# Altium project flying_pcb_v1.2.PrjPcb (part 2 of 2)
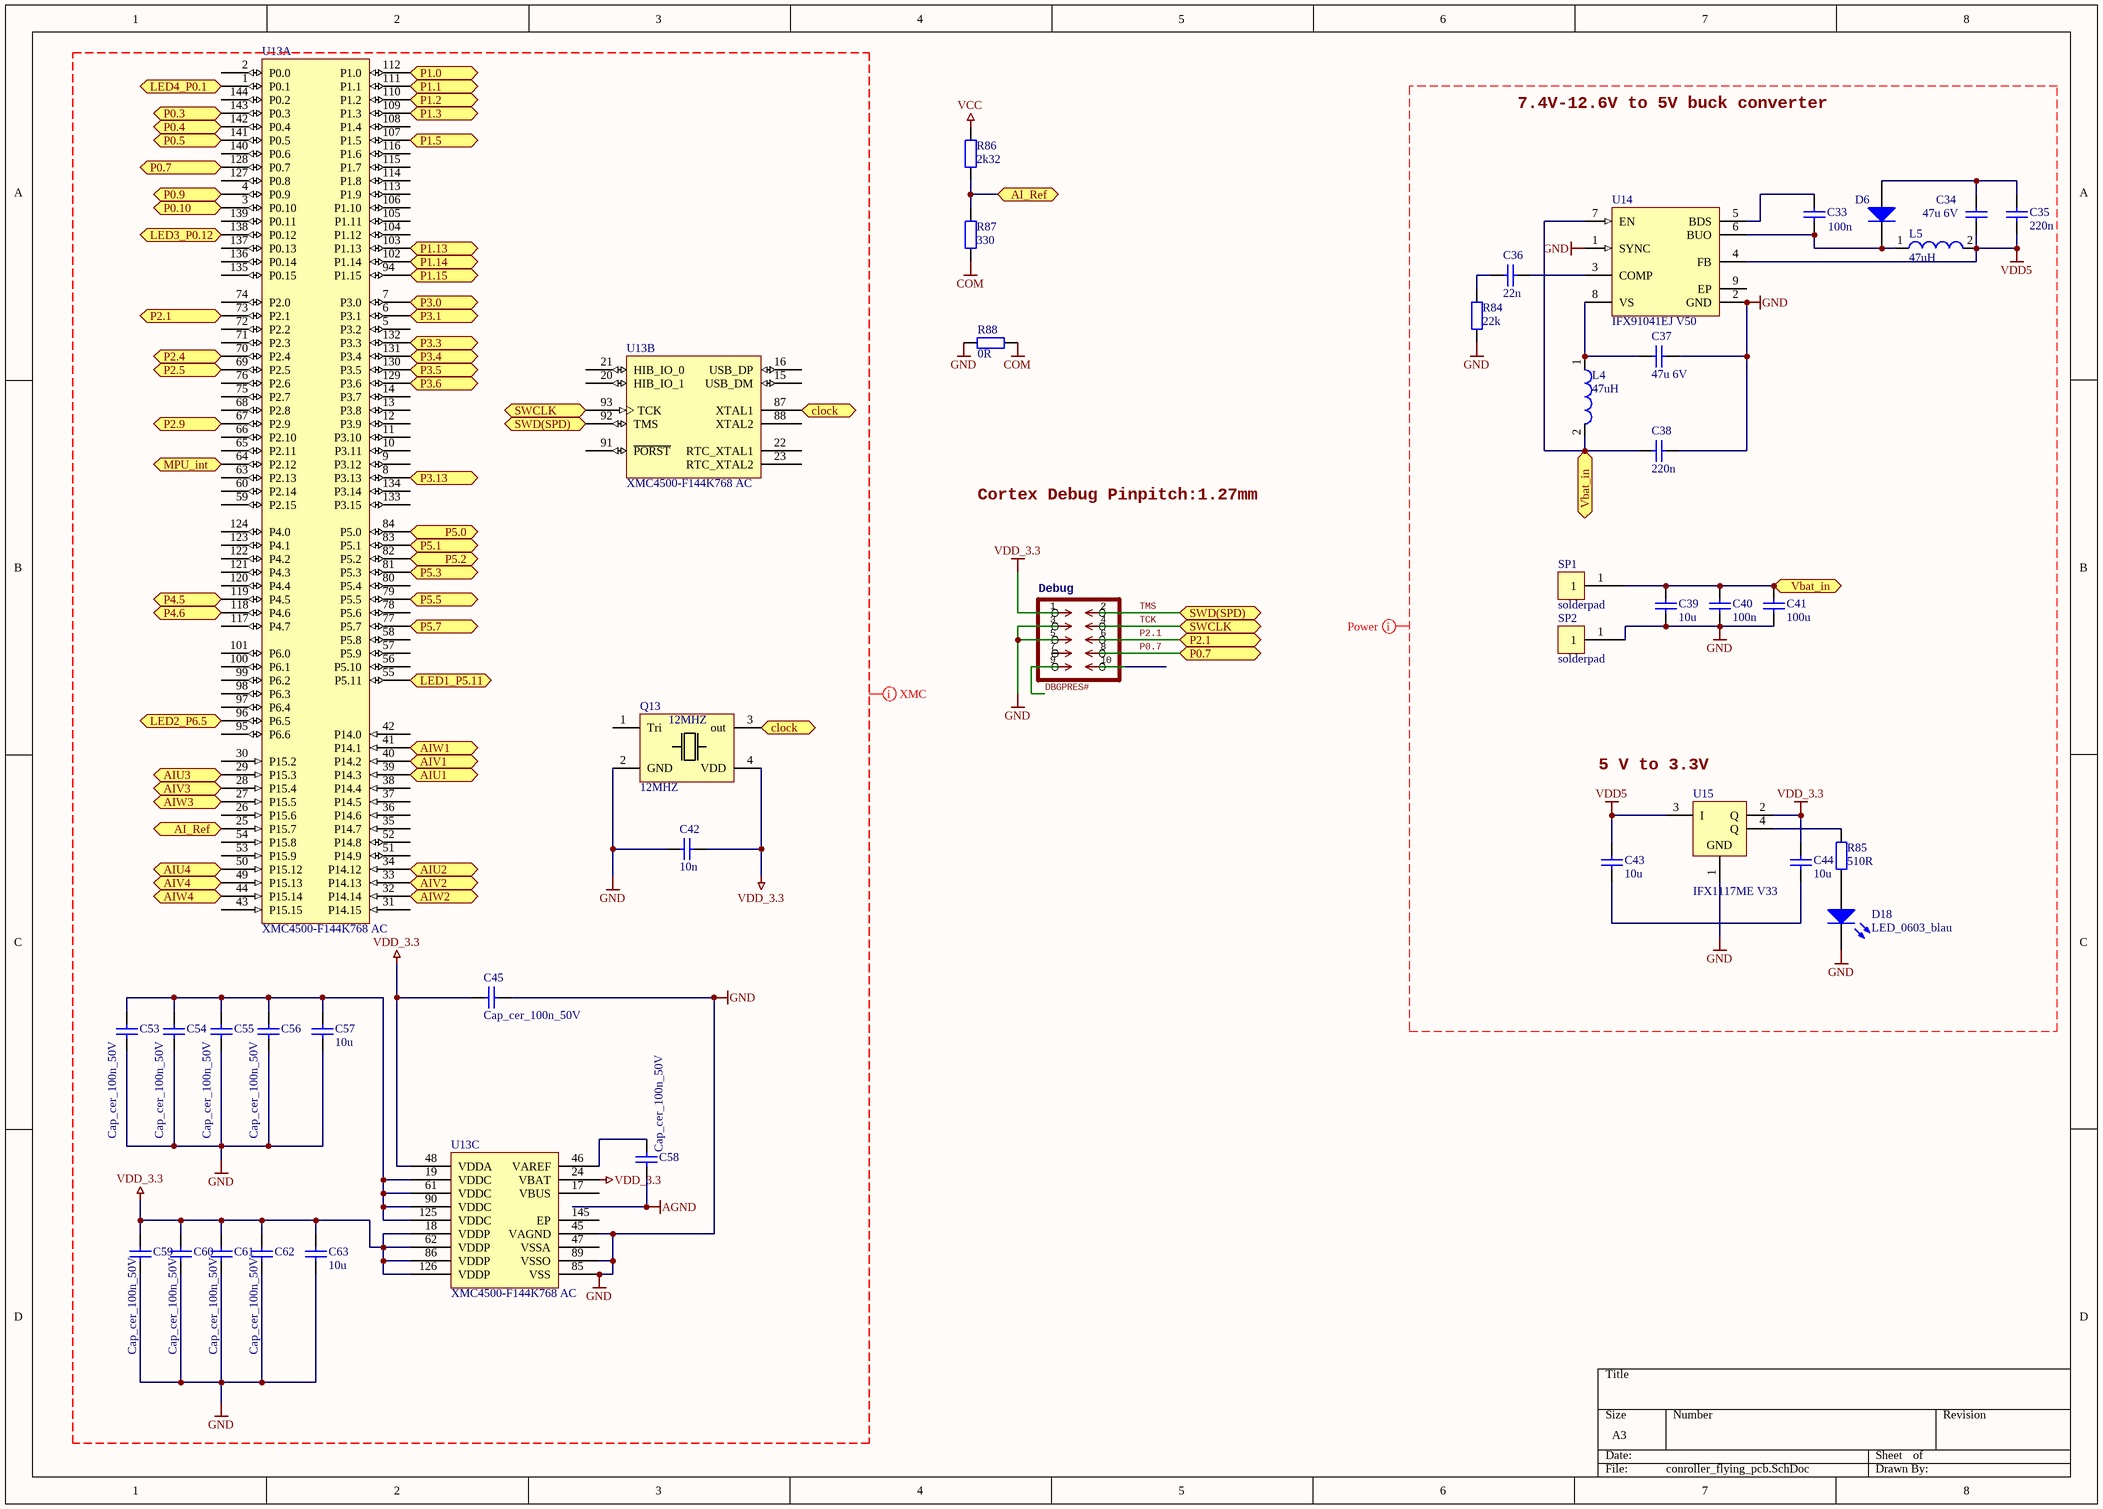
[diagram p7: conroller_flying_pcb.SchDoc]

## Nets that join several sheets
COM: Master_flying_pcb_v1 (24 pins), Slave1_flying_pcb_v1 (23 pins), Slave2_flying_pcb_v1 (23 pins), Slave3_flying_pcb_v1 (23 pins), Slave4_flying_pcb_v1 (23 pins), conroller_flying_pcb (R87.2 R88.2)
GND: Slave1_flying_pcb_v1 (D4.2), Slave2_flying_pcb_v1 (D8.2), Slave3_flying_pcb_v1 (D12.2), Slave4_flying_pcb_v1 (D16.2), Sensors_flying_pcb (38 pins), conroller_flying_pcb (30 pins)
VCC: Master_flying_pcb_v1 (24 pins), Slave1_flying_pcb_v1 (20 pins), Slave2_flying_pcb_v1 (20 pins), Slave3_flying_pcb_v1 (20 pins), Slave4_flying_pcb_v1 (20 pins), conroller_flying_pcb (R86.1)
VDD_3.3: Sensors_flying_pcb (21 pins), conroller_flying_pcb (17 pins)
NetDPS310_P3: Sensors_flying_pcb (DPS310.P3 R82.1), conroller_flying_pcb (U13.6)
NetDPS310_P4: Sensors_flying_pcb (DPS310.P4 R83.1), conroller_flying_pcb (U13.8)
NetDPS310_P5: Sensors_flying_pcb (DPS310.P5), conroller_flying_pcb (U13.7)
NetPAN1026_E6: Sensors_flying_pcb (PAN1026.E6 R79.2 RN42.UART_RX), conroller_flying_pcb (U13.83)
NetPAN1026_F7: Sensors_flying_pcb (PAN1026.F7 R78.2 RN42.UART_TX), conroller_flying_pcb (U13.107)
NetQ14_12: Sensors_flying_pcb (Q14.12), conroller_flying_pcb (U13.64)
NetQ14_23: Sensors_flying_pcb (Q14.23 R80.1), conroller_flying_pcb (U13.82)
NetQ14_24: Sensors_flying_pcb (Q14.24 R81.1), conroller_flying_pcb (U13.84)
NetR3_2: Slave1_flying_pcb_v1 (R3.2 R6.1), conroller_flying_pcb (U13.39)
NetR9_2: Slave1_flying_pcb_v1 (R9.2 R12.1), conroller_flying_pcb (U13.40)
NetR15_2: Slave1_flying_pcb_v1 (R15.2 R18.1), conroller_flying_pcb (U13.41)
NetR19_1: Slave1_flying_pcb_v1 (R19.1), conroller_flying_pcb (U13.55)
NetR22_2: Slave2_flying_pcb_v1 (R22.2 R25.1), conroller_flying_pcb (U13.34)
NetR28_2: Slave2_flying_pcb_v1 (R28.2 R31.1), conroller_flying_pcb (U13.33)
NetR34_2: Slave2_flying_pcb_v1 (R34.2 R37.1), conroller_flying_pcb (U13.32)
NetR38_1: Slave2_flying_pcb_v1 (R38.1), conroller_flying_pcb (U13.96)
NetR41_2: Slave3_flying_pcb_v1 (R41.2 R44.1), conroller_flying_pcb (U13.29)
NetR47_2: Slave3_flying_pcb_v1 (R47.2 R50.1), conroller_flying_pcb (U13.28)
NetR53_2: Slave3_flying_pcb_v1 (R53.2 R56.1), conroller_flying_pcb (U13.27)
NetR57_1: Slave3_flying_pcb_v1 (R57.1), conroller_flying_pcb (U13.138)
NetR60_2: Slave4_flying_pcb_v1 (R60.2 R63.1), conroller_flying_pcb (U13.50)
NetR66_2: Slave4_flying_pcb_v1 (R66.2 R69.1), conroller_flying_pcb (U13.49)
NetR72_2: Slave4_flying_pcb_v1 (R72.2 R75.1), conroller_flying_pcb (U13.44)
NetR76_1: Slave4_flying_pcb_v1 (R76.1), conroller_flying_pcb (U13.1)
NetU1_2: Slave1_flying_pcb_v1 (U1.2), conroller_flying_pcb (U13.141)
NetU1_3: Slave1_flying_pcb_v1 (U1.3), conroller_flying_pcb (U13.3)
NetU2_2: Slave1_flying_pcb_v1 (U2.2), conroller_flying_pcb (U13.142)
NetU2_3: Slave1_flying_pcb_v1 (U2.3), conroller_flying_pcb (U13.4)
NetU3_2: Slave1_flying_pcb_v1 (U3.2), conroller_flying_pcb (U13.143)
NetU3_3: Slave1_flying_pcb_v1 (U3.3), conroller_flying_pcb (U13.67)
NetU4_2: Slave2_flying_pcb_v1 (U4.2), conroller_flying_pcb (U13.94)
NetU4_3: Slave2_flying_pcb_v1 (U4.3), conroller_flying_pcb (U13.77)
NetU5_2: Slave2_flying_pcb_v1 (U5.2), conroller_flying_pcb (U13.102)
NetU5_3: Slave2_flying_pcb_v1 (U5.3), conroller_flying_pcb (U13.79)
NetU6_2: Slave2_flying_pcb_v1 (U6.2), conroller_flying_pcb (U13.103)
NetU6_3: Slave2_flying_pcb_v1 (U6.3), conroller_flying_pcb (U13.81)
NetU7_2: Slave3_flying_pcb_v1 (U7.2), conroller_flying_pcb (U13.109)
NetU7_3: Slave3_flying_pcb_v1 (U7.3), conroller_flying_pcb (U13.110)
NetU8_2: Slave3_flying_pcb_v1 (U8.2), conroller_flying_pcb (U13.111)
NetU8_3: Slave3_flying_pcb_v1 (U8.3), conroller_flying_pcb (U13.112)
NetU9_2: Slave3_flying_pcb_v1 (U9.2), conroller_flying_pcb (U13.69)
NetU9_3: Slave3_flying_pcb_v1 (U9.3), conroller_flying_pcb (U13.70)
NetU10_2: Slave4_flying_pcb_v1 (U10.2), conroller_flying_pcb (U13.129)
NetU10_3: Slave4_flying_pcb_v1 (U10.3), conroller_flying_pcb (U13.130)
NetU11_2: Slave4_flying_pcb_v1 (U11.2), conroller_flying_pcb (U13.131)
NetU11_3: Slave4_flying_pcb_v1 (U11.3), conroller_flying_pcb (U13.132)
NetU12_2: Slave4_flying_pcb_v1 (U12.2), conroller_flying_pcb (U13.118)
NetU12_3: Slave4_flying_pcb_v1 (U12.3), conroller_flying_pcb (U13.119)

## Assembly variants
RN42: not fitted PAN1026
Panasonic PAN1026: not fitted RN42